# Altium project COEX PDB PROJECT.PrjPCB
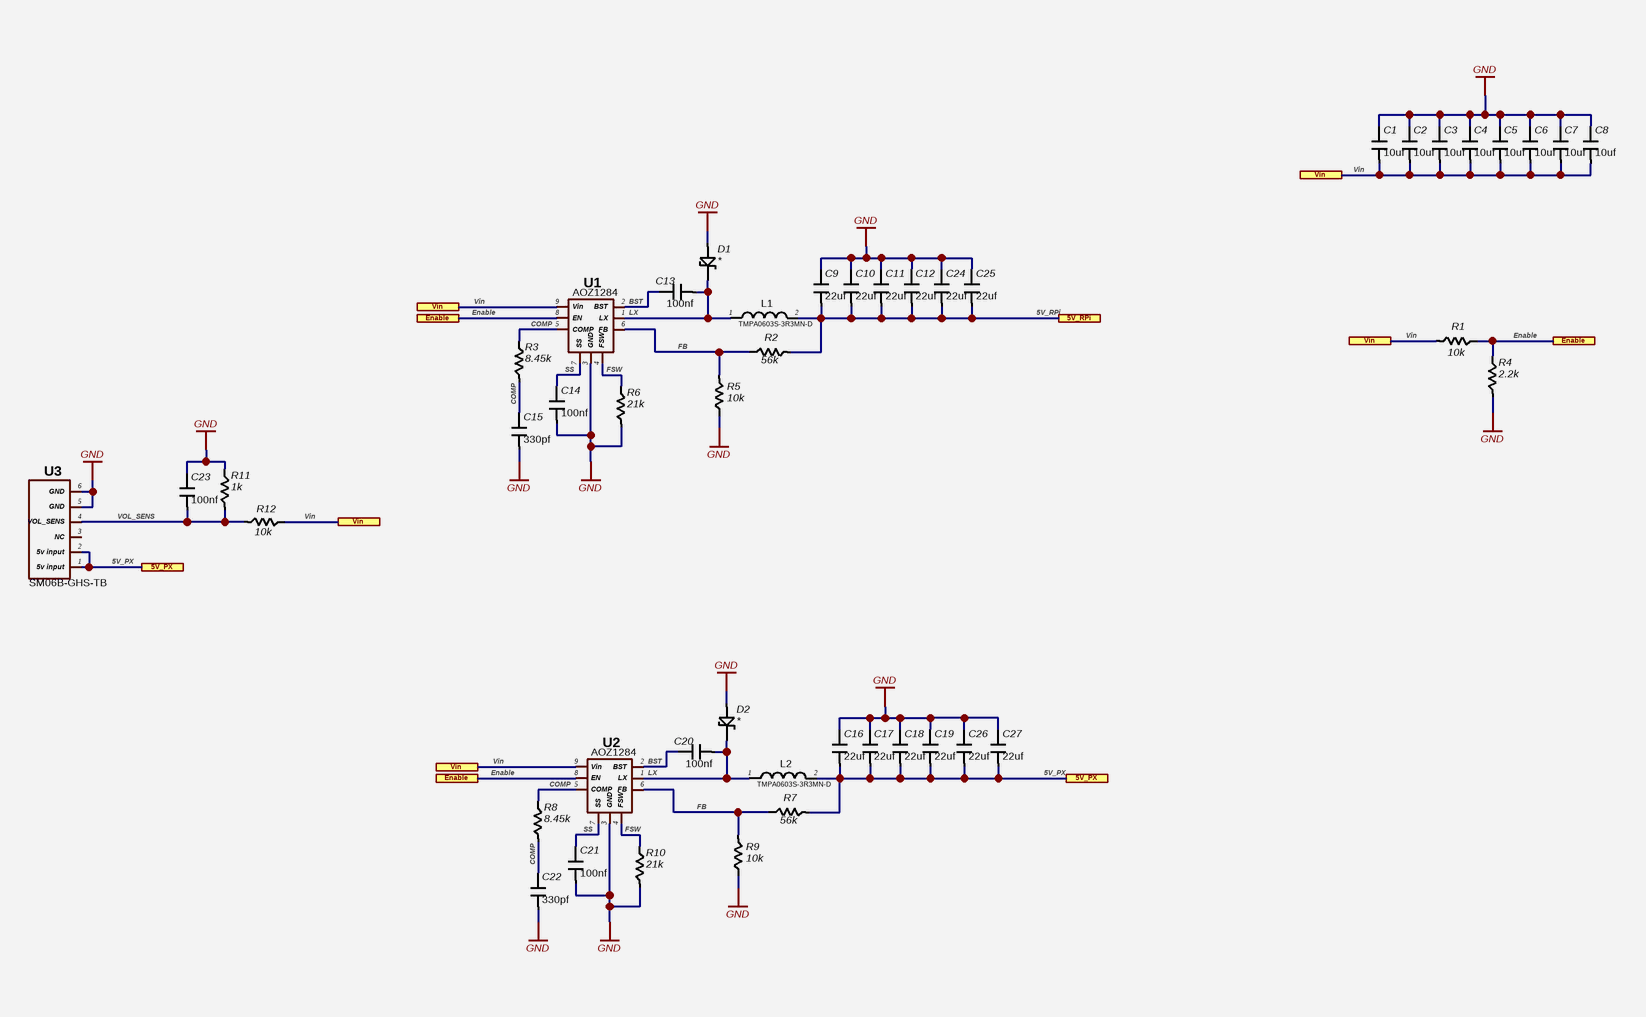
[diagram p0: COEX PDB schematics.SchDoc]
1 sheet, 46 parts. Net scope: flat (ports and power ports of the same name join across sheets).
Board file: COEX PDB PCB.PcbDoc

## Sheet COEX PDB schematics.SchDoc
size A4

### Parts
C1  10uf  [Capasitor 0805]
C2  10uf  [Capasitor 0805]
C3  10uf  [Capasitor 0805]
C4  10uf  [Capasitor 0805]
C5  10uf  [Capasitor 0805]
C6  10uf  [Capasitor 0805]
C7  10uf  [Capasitor 0805]
C8  10uf  [Capasitor 0805]
C9  22uf  [Capasitor 0603]
C10  22uf  [Capasitor 0603]
C11  22uf  [Capasitor 0603]
C12  22uf  [Capasitor 0603]
C13  100nf  [Capasitor 0402]
C14  100nf  [Capasitor 0402]
C15  330pf  [Capasitor 0402]
C16  22uf  [Capasitor 0603]
C17  22uf  [Capasitor 0603]
C18  22uf  [Capasitor 0603]
C19  22uf  [Capasitor 0603]
C20  100nf  [Capasitor 0402]
C21  100nf  [Capasitor 0402]
C22  330pf  [Capasitor 0402]
C23  100nf  [Capasitor 0402]
C24  22uf  [Capasitor 0603]
C25  22uf  [Capasitor 0603]
C26  22uf  [Capasitor 0603]
C27  22uf  [Capasitor 0603]
D1  *  [SOD-123FL]
D2  *  [SOD-123FL]
L1  TMPA0603S-3R3MN-D  [Inductor SMD 7.1x6.6]
L2  TMPA0603S-3R3MN-D  [Inductor SMD 7.1x6.6]
R1  10k  [Resistor 0402]
R2  56k  [Resistor 0402]
R3  8.45k  [Resistor 0402]
R4  2.2k  [Resistor 0402]
R5  10k  [Resistor 0402]
R6  21k  [Resistor 0402]
R7  56k  [Resistor 0402]
R8  8.45k  [Resistor 0402]
R9  10k  [Resistor 0402]
R10  21k  [Resistor 0402]
R11  1k  [Resistor 0402]
R12  10k  [Resistor 0402]
U1  AOZ1284  [SOIC-8 (Thermal pad)]
U2  AOZ1284  [SOIC-8 (Thermal pad)]
U3  SM06B-GHS-TB  [JST-GH 6 PIN]

### Ports
5V_PX, 5V_RPi, Enable, Vin

### Nets
GND: C1.1 C2.1 C3.1 C4.1 C5.1 C6.1 C7.1 C8.1 C9.1 C10.1 C11.1 C12.1 C14.2 C15.2 C16.1 C17.1 C18.1 C19.1 C21.2 C22.2 C23.1 C24.1 C25.1 C26.1 C27.1 D1.2 D2.2 R4.2 R5.1 R6.2 R9.1 R10.2 R11.1 U1.3(GND) U2.3(GND) U3.5(GND) U3.6(GND)
5V_PX: C16.2 C17.2 C18.2 C19.2 C26.2 C27.2 L2.2 R7.2 U3.1(5v_input) U3.2(5v_input) ; port 5V_PX
5V_RPi: C9.2 C10.2 C11.2 C12.2 C24.2 C25.2 L1.2 R2.2 ; port 5V_RPi
BST: C13.1 C20.1 U1.2(BST) U2.2(BST)
COMP: C15.1 C22.1 R3.1 R3.2 R8.1 R8.2 U1.5(COMP) U2.5(COMP)
Enable: R1.1 R4.1 U1.8(EN) U2.8(EN) ; port Enable
FB: R2.1 R5.2 R7.1 R9.2 U1.6(FB) U2.6(FB)
FSW: R6.1 R10.1 U1.4(FSW) U2.4(FSW)
LX: C13.2 C20.2 D1.1 D2.1 L1.1 L2.1 U1.1(LX) U2.1(LX)
SS: C14.1 C21.1 U1.7(SS) U2.7(SS)
Vin: C1.2 C2.2 C3.2 C4.2 C5.2 C6.2 C7.2 C8.2 R1.2 R12.1 U1.9(Vin) U2.9(Vin) ; port Vin
VOL_SENS: C23.2 R11.2 R12.2 U3.4(VOL_SENS)

Not connected (* = marked no-connect by the designer): U3 3(NC)

### Library data of the parts
C1-C8 = Capacitor MLCC: Multilayer Ceramic Capacitors MLCC - SMD/SMT 10uF 35V 0805; Part number: GRM21BR6YA106KE43L; Manufacturer: Murata Electronics; Component package: 0805; HelpURL: https://lcsc.com/product-detail/Multilayer-Ceramic-Capacitors-MLCC-SMD-SMT_MuRata_GRM21BR6YA106KE43L_10uF-106-10-35V_C162422.html; Value: 10uf
C9-C12 C16-C19 C24-C27 = Capacitor MLCC: Multilayer Ceramic Capacitors MLCC - SMD/SMT 22uF 10V 0603; Part number: CL10A226MP8NUNE; Manufacturer: Samsung Electro-Mechanics; Component package: 0603; HelpURL: https://lcsc.com/product-detail/Multilayer-Ceramic-Capacitors-MLCC-SMD-SMT_SAMSUNG_CL10A226MP8NUNE_22uF-226-20-10V_C86295.html; Value: 22uf
C13 C14 C20 C21 C23 = Capacitor MLCC: Multilayer Ceramic Capacitors MLCC - SMD/SMT 100nF 25V 0402; Part number: 0402B104J250NT; Manufacturer: Guangdong Fenghua Advanced Tech; Component package: 0402; HelpURL: https://lcsc.com/product-detail/Others_Guangdong-Fenghua-Advanced-Tech-0402B104J250NT_C301928.html; Value: 100nf
C15 C22 = Capacitor MLCC: Multilayer Ceramic Capacitors MLCC - SMD/SMT 330pF 50V 0402; Part number: CC0402JRNPO9BN331; Manufacturer: YAGEO; Component package: 0402; HelpURL: https://lcsc.com/product-detail/Multilayer-Ceramic-Capacitors-MLCC-SMD-SMT_YAGEO-CC0402JRNPO9BN331_C107006.html; Value: 330pf
D1 D2 = Schottky barrier diode: Schottky Barrier Diodes (SBD) SOD-123; Part number: DSK34; Manufacturer: Microdiode Electronics; HelpURL: https://lcsc.com/product-detail/Schottky-Barrier-Diodes-SBD_MDD-Microdiode-Electronics-DSK34_C41029.html; Component package: SOD-123; Value: *
L1 L2 = FB / Inductor: Power Inductors 3.3uH ±20% 6.5A SMD,7.1x6.6x2.8mm; Manufacturer: TAITEC; Part number: TMPA0603S-3R3MN-D; HelpURL: https://lcsc.com/product-detail/Power-Inductors_TAITEC-TMPA0603S-3R3MN-D_C305190.html; Component package: SMD,7.1x6.6x2.8mm; Value: 3.3uh
R1 R5 R9 R12 = Resistor: Chip Resistor - Surface Mount 10KOhms ±1% 1/16W 0402; Part number: RC0402FR-0710KL; Manufacturer: YAGEO; Component package: 0402; HelpURL: https://lcsc.com/product-detail/Chip-Resistor-Surface-Mount_10KR-1002-1_C60490.html; Value: 10k
R2 R7 = Resistor: Chip Resistor - Surface Mount 56KOhms ±1% 1/16W 0402; Part number: RC0402FR-0756KL; Manufacturer: YAGEO; Component package: 0402; HelpURL: https://lcsc.com/product-detail/Chip-Resistor-Surface-Mount_56KR-5602-1_C114756.html; Value: 56k
R3 R8 = Resistor: Chip Resistor - Surface Mount 8.45KOhms ±1% 1/16W 0402; Part number: 0402WGF8451TCE; Manufacturer: Uniroyal Elec; Component package: 0402; HelpURL: https://lcsc.com/product-detail/Chip-Resistor-Surface-Mount_Uniroyal-Elec-0402WGF8451TCE_C270579.html; Value: 8.45k
R4 = Resistor: Chip Resistor - Surface Mount 2.2KOhms ±1% 1/16W 0402; Part number: RC0402FR-072K2L; Manufacturer: YAGEO; Component package: 0402; HelpURL: https://lcsc.com/product-detail/Chip-Resistor-Surface-Mount_2-2KR-2201-1_C114762.html; Value: 2.2k
R6 R10 = Resistor: Chip Resistor - Surface Mount 21KOhms ±1% 1/16W 0402; Part number: RC0402FR-0721KL; Manufacturer: YAGEO; Component package: 0402; HelpURL: https://lcsc.com/product-detail/Chip-Resistor-Surface-Mount_21KR-2102-1_C185441.html; Value: 21k
R11 = Resistor: Chip Resistor - Surface Mount 1KOhms ±1% 1/16W 0402; Part number: RC0402FR-071KL; Manufacturer: YAGEO; Component package: 0402; HelpURL: https://lcsc.com/product-detail/Chip-Resistor-Surface-Mount_1KR-1001-1_C106235.html; Value: 1k
U1 U2 = AOZ1284: DC-DC Converters Step-Down Adjustable 1 3V 36V 0.8V 30V 4A SOP-8_EP_150mil; Manufacturer: Alpha and omega; Component package: SOT23-5; Part number: AOZ1284; HelpURL: https://lcsc.com/product-detail/DC-DC-Converters_AOS_AOZ1284PI_AOZ1284PI_C48060.html
U3 = JST-GH 6: Manufacturer: JST Sales America; Part number: SM06B-GHS-TB; HelpURL: https://lcsc.com/product-detail/Wire-To-Board-Wire-To-Wire-Connector_JST-Sales-America_SM06B-GHS-TB-LF-SN_JST-Sales-America-SM06B-GHS-TB-LF-SN_C133065.html